# EAGLE design Puzzle Circular LED v0.9b (EAGLE 6.2)
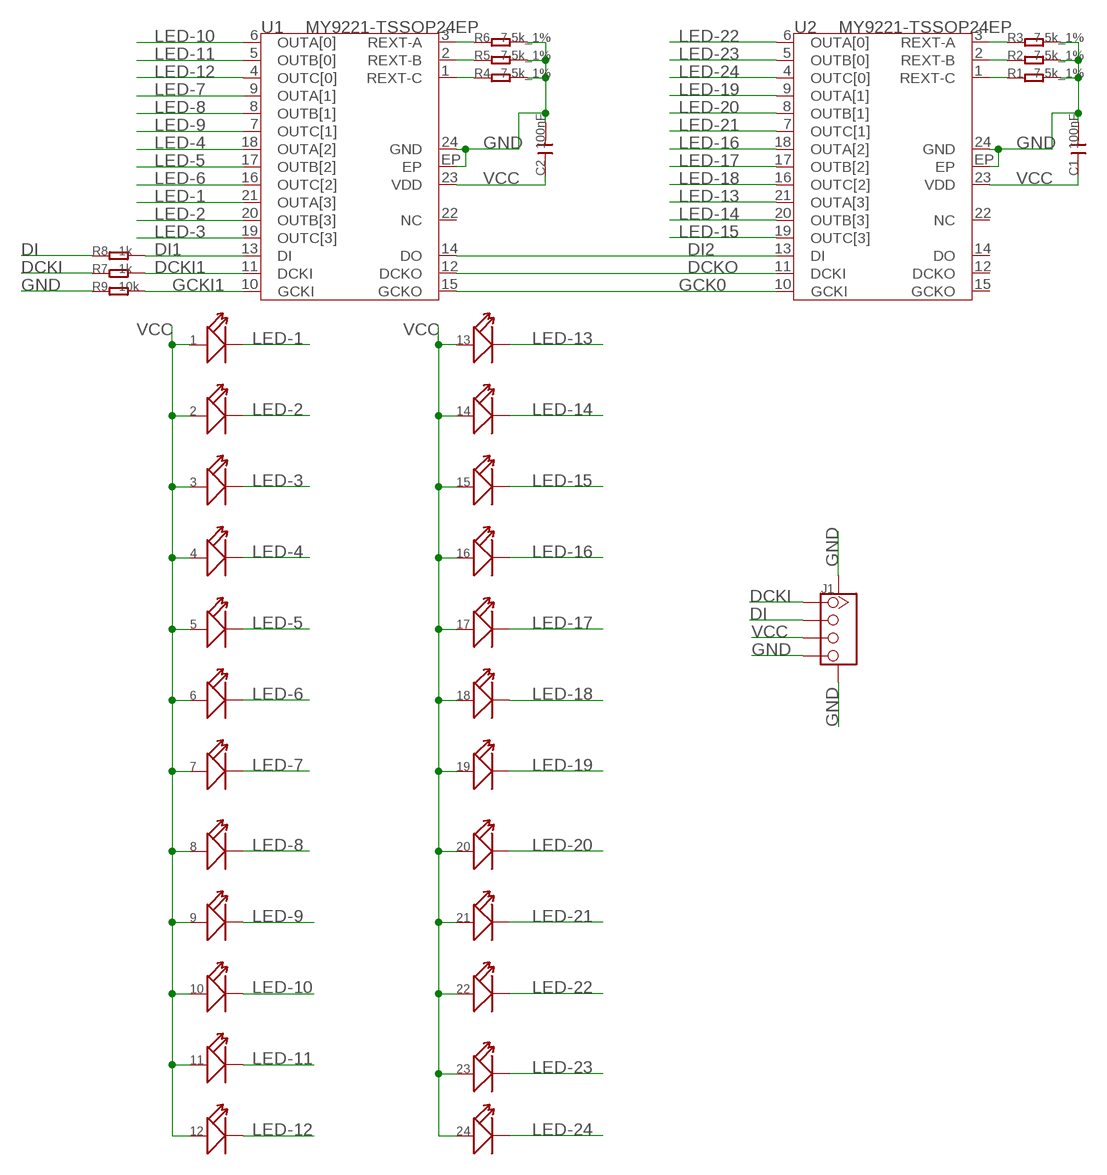
[diagram p0: schematic, sheet 1]

## Parts
1  LED'1206'  [LED-1206]
2  LED'1206'  [LED-1206]
3  LED'1206'  [LED-1206]
4  LED'1206'  [LED-1206]
5  LED'1206'  [LED-1206]
6  LED'1206'  [LED-1206]
7  LED'1206'  [LED-1206]
8  LED'1206'  [LED-1206]
9  LED'1206'  [LED-1206]
10  LED'1206'  [LED-1206]
11  LED'1206'  [LED-1206]
12  LED'1206'  [LED-1206]
13  LED'1206'  [LED-1206]
14  LED'1206'  [LED-1206]
15  LED'1206'  [LED-1206]
16  LED'1206'  [LED-1206]
17  LED'1206'  [LED-1206]
18  LED'1206'  [LED-1206]
19  LED'1206'  [LED-1206]
20  LED'1206'  [LED-1206]
21  LED'1206'  [LED-1206]
22  LED'1206'  [LED-1206]
23  LED'1206'  [LED-1206]
24  LED'1206'  [LED-1206]
C1  100nF  C-0603  [C0603]
C2  100nF  C-0603  [C0603]
J1  TWIG-4P-2.0-SMD-FEMALE-REINFORCE'90D'  [4P-SMD-2.0-90D]
R1  7.5k_1%  R-0603  [R0603]
R2  7.5k_1%  R-0603  [R0603]
R3  7.5k_1%  R-0603  [R0603]
R4  7.5k_1%  R-0603  [R0603]
R5  7.5k_1%  R-0603  [R0603]
R6  7.5k_1%  R-0603  [R0603]
R7  1k  R-0603  [R0603]
R8  1k  R-0603  [R0603]
R9  10k  R-0603  [R0603]
U1  MY9221-TSSOP24EP  [TSSOP24EP]
U2  MY9221-TSSOP24EP  [TSSOP24EP]

## Nets
DCKI: J1.1 R7.1
DCKI1: R7.2 U1.11(DCKI)
DCKO: U1.12(DCKO) U2.11(DCKI)
DI: J1.2 R8.1
DI1: R8.2 U1.13(DI)
DI2: U1.14(DO) U2.13(DI)
GCK0: U1.15(GCKO) U2.10(GCKI)
GCKI1: R9.2 U1.10(GCKI)
GND: C1.2 C2.2 J1.4 J1.SS1 J1.SS2 R1.2 R2.2 R3.2 R4.2 R5.2 R6.2 R9.1 U1.24(GND) U1.EP U2.24(GND) U2.EP
LED-1: 1.- U1.21(OUTA[3])
LED-2: 2.- U1.20(OUTB[3])
LED-3: 3.- U1.19(OUTC[3])
LED-4: 4.- U1.18(OUTA[2])
LED-5: 5.- U1.17(OUTB[2])
LED-6: 6.- U1.16(OUTC[2])
LED-7: 7.- U1.9(OUTA[1])
LED-8: 8.- U1.8(OUTB[1])
LED-9: 9.- U1.7(OUTC[1])
LED-10: 10.- U1.6(OUTA[0])
LED-11: 11.- U1.5(OUTB[0])
LED-12: 12.- U1.4(OUTC[0])
LED-13: 13.- U2.21(OUTA[3])
LED-14: 14.- U2.20(OUTB[3])
LED-15: 15.- U2.19(OUTC[3])
LED-16: 16.- U2.18(OUTA[2])
LED-17: 17.- U2.17(OUTB[2])
LED-18: 18.- U2.16(OUTC[2])
LED-19: 19.- U2.9(OUTA[1])
LED-20: 20.- U2.8(OUTB[1])
LED-21: 21.- U2.7(OUTC[1])
LED-22: 22.- U2.6(OUTA[0])
LED-23: 23.- U2.5(OUTB[0])
LED-24: 24.- U2.4(OUTC[0])
N$5: R1.1 U2.1(REXT-C)
N$6: R2.1 U2.2(REXT-B)
N$7: R4.1 U1.1(REXT-C)
N$8: R5.1 U1.2(REXT-B)
N$9: R6.1 U1.3(REXT-A)
N$10: R3.1 U2.3(REXT-A)
VCC: 1.+ 2.+ 3.+ 4.+ 5.+ 6.+ 7.+ 8.+ 9.+ 10.+ 11.+ 12.+ 13.+ 14.+ 15.+ 16.+ 17.+ 18.+ 19.+ 20.+ 21.+ 22.+ 23.+ 24.+ C1.1 C2.1 J1.3 U1.23(VDD) U2.23(VDD)
Unconnected: U1.22(NC) U2.12(DCKO) U2.14(DO) U2.15(GCKO) U2.22(NC)

## Library data of the parts
1-24 = Discrete:LED*
C1 C2 = Discrete:C*: Ceramic Capacitors
J1 = Connector:TWIG-4P-2.0-SMD-FEMALE-REINFORCE
R1-R9 = Discrete:R*
U1 U2 = For_Test_Albert:MY9221

## Net classes
0 default: width 0.203 mm, drill 0.305 mm, clearance 0.152 mm

## Board
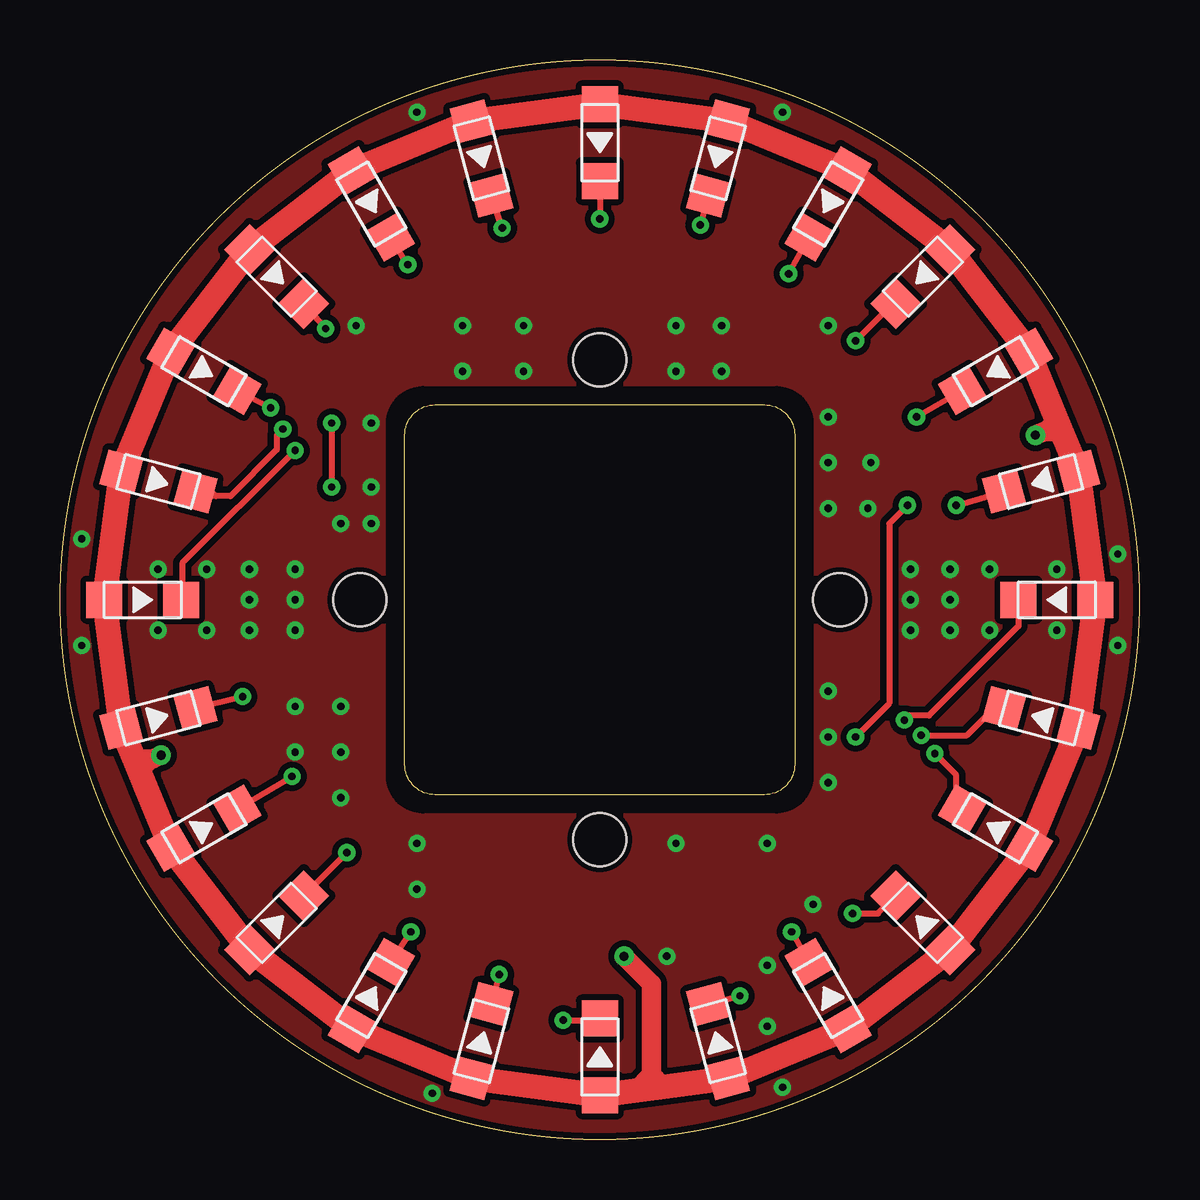
[diagram p1: board, top side]
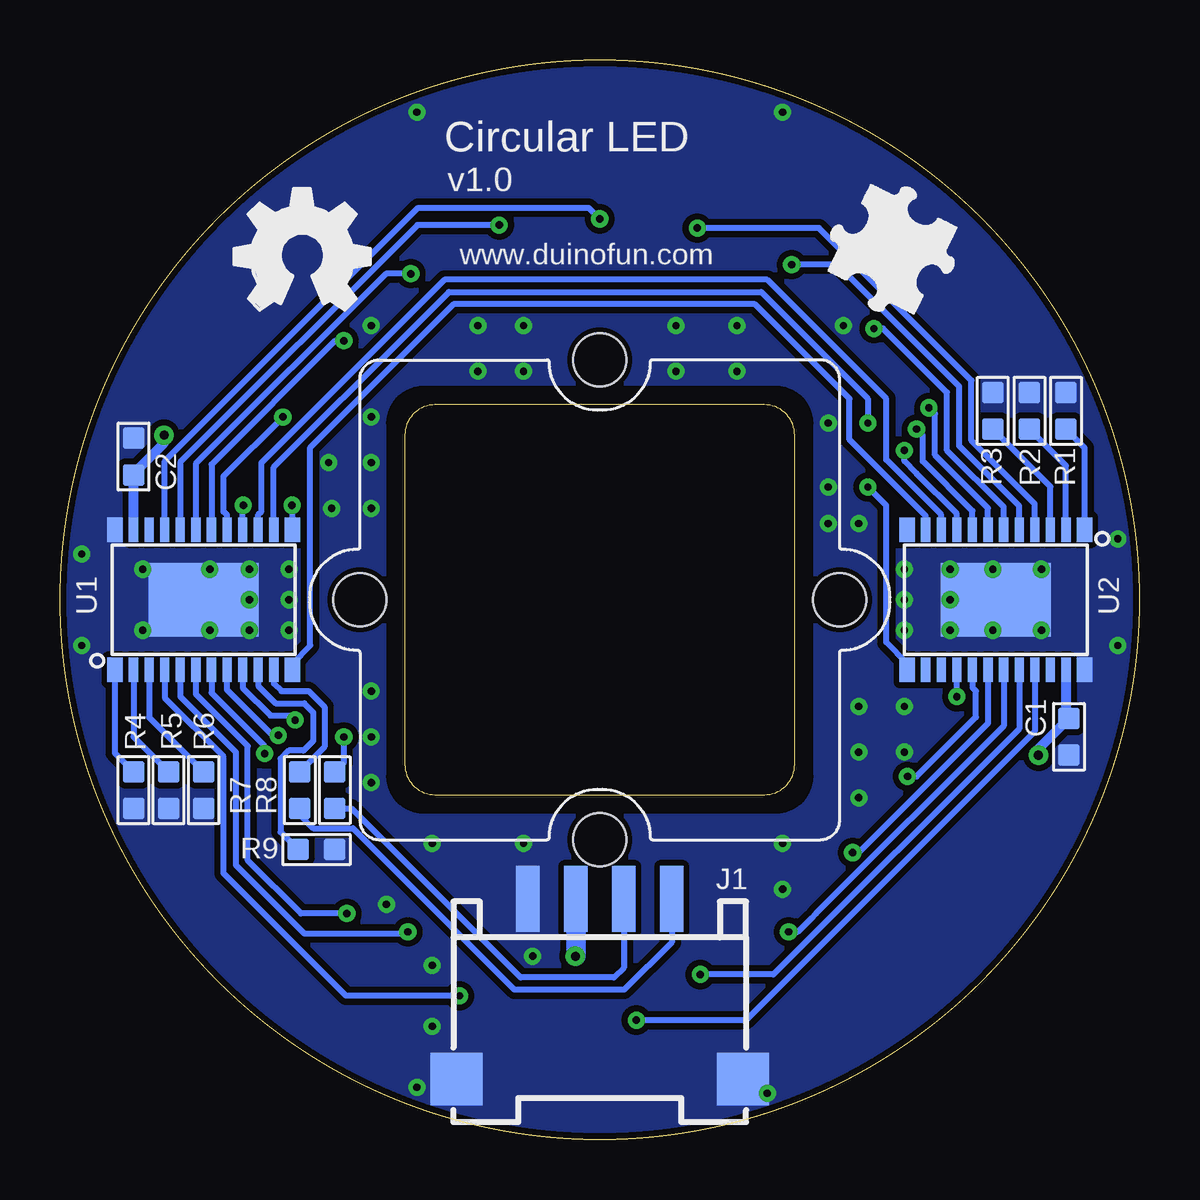
[diagram p2: board, bottom side, seen from below]

Size 45 x 45 mm. Coordinates in mm from the lower left corner, seen from the top.
Outline: 15.64,30.63 29.36,30.63 arc-90 30.63,29.36 30.63,15.64 arc-90 29.36,14.37 15.64,14.37 arc-90 14.37,15.64 14.37,29.36 arc-90 15.64,30.63
Outline: circle at 22.5,22.5 radius 22.5
Copper layers (1*16): Top 0.035mm / dielectric 1.5mm / Bottom 0.035mm
Design rules: minimum track width 8mil, minimum drill 12mil, track to track 8mil, track to pad 8mil, pad to pad 8mil, via to via 8mil, smd to smd 0mil, copper to edge 10mil, drill to drill 8mil, minimum pad ring 10mil, minimum via ring 8mil, stop-mask expansion 4mil, vias tented up to drill 100mil, thermal gap 10mil
Holes 2.2 mm at 22.5,32.5 22.5,12.5
tRestrict: 10 lines
bRestrict: 8 lines

### Footprints (pad centres in the part's own frame; a part is rotated, then mirrored left to right if it is on the bottom)
LED-1206 = smd 1.5 x 1.5: + -1.6,0; - 1.6,0
C0603 = smd 0.889 x 0.889: 1 -0.762,0; 2 0.762,0
4P-SMD-2.0-90D = smd 0.965 x 2.74: 1 -3,-0.1; 2 -1,-0.1; 3 1,-0.1; 4 3,-0.1 | smd 2.159 x 2.184: SS1 -5.974,7.4; SS2 5.974,7.4
R0603 = smd 0.889 x 0.889: 1 -0.762,0; 2 0.762,0
TSSOP24EP = smd 0.635 x 1.016: 1 -3.702,-2.921; 12 3.702,-2.921; 13 3.702,2.921; 24 -3.702,2.921 | smd 0.381 x 1.016: 2 -2.925,-2.921; 3 -2.275,-2.921; 4 -1.625,-2.921; 5 -0.975,-2.921; 6 -0.325,-2.921; 7 0.325,-2.921; 8 0.975,-2.921; 9 1.625,-2.921; 10 2.275,-2.921; 11 2.925,-2.921; 14 2.925,2.921; 15 2.275,2.921; 16 1.625,2.921; 17 0.975,2.921; 18 0.325,2.921; 19 -0.325,2.921; 20 -0.975,2.921; 21 -1.625,2.921; 22 -2.275,2.921; 23 -2.925,2.921 | smd 4.572 x 3.048: EP 0,0
1U-DIM-W/-DRILL-SILK = hole 2.2: 0,-10; 0,10

### Placement (x,y rotation side)
1  22.5,41.55 270 top
2  27.43,40.9 255 top
3  32.02,39 240 top
4  35.97,35.97 225 top
5  39,32.02 210 top
6  40.9,27.43 195 top
7  41.55,22.5 180 top
8  40.9,17.57 165 top
9  39,12.97 150 top
10  35.97,9.03 135 top
11  32.02,6 120 top
12  27.43,4.1 105 top
13  22.5,3.45 90 top
14  17.57,4.1 75 top
15  12.97,6 60 top
16  9.03,9.03 45 top
17  6,12.97 30 top
18  4.1,17.57 15 top
19  3.45,22.5 0 top
20  4.1,27.43 345 top
21  6,32.02 330 top
22  9.03,35.97 315 top
23  12.97,39 300 top
24  17.57,40.9 285 top
C1  2.94,16.79 270 bottom
C2  41.93,28.47 90 bottom
J1  22.5,9.93 180 bottom
R1  3.07,30.37 90 bottom
R2  4.59,30.37 90 bottom
R3  6.12,30.37 90 bottom
R4  41.93,14.56 270 bottom
R5  40.47,14.56 270 bottom
R6  39.01,14.56 270 bottom
R7  35.01,14.56 90 bottom
R8  33.55,14.56 90 bottom
R9  34.31,12.09 180 bottom
U1  39.01,22.5 0 bottom
U2  5.99,22.5 180 bottom
U$1  [BRICK-LOGO-2-B-MIL-0.6]  7.26,34.06 0 top
U$2  [1U-DIM-W/-DRILL-SILK]  22.5,22.5 90 bottom
U$4  [OSHW_FILLX200_NOTEXT]  37.74,34.56 0 bottom

### Tracks (layer width: path | path; a pad name or v marks a point on that pad's centre or on a via)
DCKI
  Bottom 0.254: J1.1 19.5,8.23 21.48,6.24 26.06,6.24 32.79,12.97 34.44,12.97 35.01,13.55 R7.1
DCKI1
  Bottom 0.254: U1.11 36.09,19 35.77,18.69 34.63,18.69 33.97,18.03 33.97,16.37 R7.2
DCKO
  Bottom 0.254: U1.12 35.31,19.85 34.56,20.59 34.56,28.85 28.6,34.82 16.02,34.82 12.09,30.88 12.09,29.17 8.91,26 U2.11
DI
  Bottom 0.254: J1.2 21.5,7.16 21.91,6.75 25.8,6.75 32.85,13.8 R8.1
DI1  (via drill 0.3 pad 0.64)
  Top 0.254: v35.33,26.44 34.56,25.68 34.56,18.18 v33.17,16.79
  Bottom 0.254: 35.33,25.44 U1.13 35.31,26.42 v35.33,26.44 | v33.17,16.79 33.17,15.71 R8.2
DI2  (via drill 0.3 pad 0.64)
  Top 0.254: v11.32,29.87 v11.32,27.2
  Bottom 0.254: U1.14 36.09,28.03 30.37,33.74 28.79,35.33 15.77,35.33 11.32,30.88 v11.32,29.87 | U2.13 9.69,19.85 10.56,20.72 10.56,26.44 v11.32,27.2
GCK0
  Bottom 0.254: U1.15 36.73,26.05 36.6,26.18 36.6,28.21 28.98,35.84 15.52,35.84 10.56,30.88 10.56,28.34 8.27,26.05 U2.10
GCKI1
  Bottom 0.254: U1.10 36.73,18.91 36.01,18.18 34.82,18.18 34.44,17.8 34.44,16.62 34.84,16.21 35.46,16.21 35.8,15.87 35.8,12.82 R9.2
GND  (via drill 0.3 pad 0.64)
  other vias: 7.89,21.23 6.12,21.23 7.89,22.5 6.12,23.77 35.45,23.77 35.45,21.23 35.45,22.5 4.09,23.77 4.09,21.23 41.55,21.23 41.55,23.77 7.89,23.77 9.8,23.77 9.8,22.5 9.8,21.23 9.8,18.05 11.71,18.05 11.71,16.15 11.71,14.24 9.8,16.15 25.68,12.34 25.29,7.64 29.48,4.72 29.48,7.26 31.39,9.8 29.48,12.34 32.02,14.88 32.02,16.79 32.02,18.69 32.02,26.31 32.02,28.21 32.02,30.12 37.11,22.5 37.11,21.23 37.11,23.77 38.76,23.77 38.76,21.23 33.68,26.31 33.8,28.21 11.71,25.68 12.97,25.68 12.97,27.2 12.97,29.87 14.88,12.34 14.88,10.44 16.79,33.93 16.79,32.02 19.32,32.02 19.32,33.93 25.68,32.02 25.68,33.93 27.58,33.93 27.58,32.02 32.02,33.93 12.34,33.93 30.12,2.18 15.52,1.93 30.12,42.82 14.88,42.82 0.91,25.04 0.91,20.59 44.09,24.41 44.09,20.59
  pour Bottom (isolate 0.254, no thermals): -0.36,46 46,46 46,-1 -0.36,-1
  pour Top (isolate 0.254, no thermals): -0.36,46 46,46 46,-1 -0.36,-1
LED-1  (via drill 0.3 pad 0.64)
  Top 0.254: 1.- v22.5,38.38
  Bottom 0.254: U1.21 40.64,28.27 30.07,38.84 22.96,38.84 v22.5,38.38
LED-2  (via drill 0.3 pad 0.64)
  Top 0.254: 2.- v26.69,38.12
  Bottom 0.254: v26.69,38.12 30.1,38.12 39.98,28.24 U1.20
LED-3  (via drill 0.3 pad 0.64)
  Top 0.254: 3.- v30.37,36.09
  Bottom 0.254: v30.37,36.09 31.42,36.09 39.34,28.17 U1.19
LED-4  (via drill 0.3 pad 0.64)
  Top 0.254: 4.- 34.71,34.84 v33.17,33.3
  Bottom 0.254: v33.17,33.3 33.53,33.3 38.69,28.14 U1.18
LED-5  (via drill 0.3 pad 0.64)
  Top 0.254: 5.- v35.71,30.12
  Bottom 0.254: v35.71,30.12 38.18,27.65 38.18,26.18 38.03,26.03 U1.17
LED-6  (via drill 0.3 pad 0.64)
  Top 0.254: v37.36,26.44 6.-
  Bottom 0.254: U1.16 37.38,26.41 v37.36,26.44
LED-7  (via drill 0.3 pad 0.64)
  Top 0.254: 7.- 39.95,21.4 36.23,17.67 35.39,17.67 v35.2,17.48
  Bottom 0.254: U1.9 37.38,18.83 36.23,17.67 35.39,17.67 v35.2,17.48
LED-8  (via drill 0.3 pad 0.64)
  Top 0.254: v35.9,16.85 37.8,16.85 38.94,17.98 8.-
  Bottom 0.254: v35.9,16.85 36.13,16.85 38.03,18.75 U1.8
LED-9  (via drill 0.3 pad 0.64)
  Top 0.254: 9.- 37.58,13.78 37.36,13.99 37.36,15.2 v36.47,16.09
  Bottom 0.254: U1.7 38.69,18.62 36.47,16.4 v36.47,16.09
LED-10  (via drill 0.3 pad 0.64)
  Top 0.254: v33.04,9.42 34.1,9.42 10.-
  Bottom 0.254: U1.6 39.34,18.57 37.17,16.4 37.17,11.63 34.96,9.42 v33.04,9.42
LED-11  (via drill 0.3 pad 0.64)
  Top 0.254: v30.5,8.66 11.-
  Bottom 0.254: U1.5 39.98,18.46 37.68,16.15 37.68,11.44 34.82,8.58 30.57,8.58 v30.5,8.66
LED-12  (via drill 0.3 pad 0.64)
  Top 0.254: 12.- v28.34,5.99
  Bottom 0.254: v28.34,5.99 33.08,5.99 38.18,11.1 38.18,15.96 40.64,18.41 U1.4
LED-13  (via drill 0.3 pad 0.64)
  Top 0.254: v20.98,4.97 22.42,4.97 13.-
  Bottom 0.254: U2.21 4.36,17.01 16.4,4.97 v20.98,4.97
LED-14  (via drill 0.3 pad 0.64)
  Top 0.254: v18.31,6.88 14.-
  Bottom 0.254: U2.20 5.02,17.12 15.26,6.88 v18.31,6.88
LED-15  (via drill 0.3 pad 0.64)
  Top 0.254: 15.- v14.63,8.66
  Bottom 0.254: U2.19 5.66,17.24 13.48,9.42 13.67,9.23 14.24,8.66 v14.63,8.66
LED-16  (via drill 0.3 pad 0.64)
  Top 0.254: 16.- v11.96,11.96
  Bottom 0.254: U2.18 6.32,17.35 11.71,11.96 v11.96,11.96
LED-17  (via drill 0.3 pad 0.64)
  Top 0.254: 17.- v9.67,15.13
  Bottom 0.254: v9.67,15.13 9.29,15.13 6.82,17.61 6.82,18.69 6.96,18.84 U2.17
LED-18  (via drill 0.3 pad 0.64)
  Top 0.254: 18.- v7.62,18.46
  Bottom 0.254: v7.62,18.46 U2.16
LED-19  (via drill 0.3 pad 0.64)
  Top 0.254: v9.8,28.72 5.1,24.02 5.1,22.55 19.-
  Bottom 0.254: U2.9 7.62,26.09 9.29,27.77 9.8,28.28 v9.8,28.72
LED-20  (via drill 0.3 pad 0.64)
  Top 0.254: v9.29,29.61 9.04,29.36 9.04,28.75 7.11,26.82 6.5,26.82 | 6.5,26.82 5.84,26.82 20.- | 6.5,26.82 6.12,27.2
  Bottom 0.254: U2.8 6.96,26.2 9.04,28.28 9.04,29.36 v9.29,29.61
LED-21  (via drill 0.3 pad 0.64)
  Top 0.254: 21.- v8.78,30.5
  Bottom 0.254: U2.7 6.32,26.32 8.53,28.53 8.53,30.25 v8.78,30.5
LED-22  (via drill 0.3 pad 0.64)
  Top 0.254: 22.- v11.07,33.8
  Bottom 0.254: U2.6 5.66,26.37 8.02,28.72 8.02,31.14 10.69,33.8 v11.07,33.8
LED-23  (via drill 0.3 pad 0.64)
  Top 0.254: v14.5,36.47 23.-
  Bottom 0.254: U2.5 5.02,26.41 7.51,28.91 7.51,31.39 12.59,36.47 v14.5,36.47
LED-24  (via drill 0.3 pad 0.64)
  Top 0.254: v18.44,37.99 24.-
  Bottom 0.254: U2.4 4.36,26.49 7.01,29.13 7.01,31.64 13.36,37.99 v18.44,37.99
N$5
  Bottom 0.254: U2.1 2.29,28.83 R1.1
N$6
  Bottom 0.254: U2.2 3.07,28.08 R2.1
N$7
  Bottom 0.254: U1.1 42.71,16.11 R4.1
N$8
  Bottom 0.254: U1.2 41.94,16.79 R5.1
N$9
  Bottom 0.254: U1.3 41.28,17.6 R6.1
N$10
  Bottom 0.254: U2.3 3.71,27.21 R3.1
VCC  (via drill 0.38 pad 0.81)
  Top 0.813: v40.66,29.36 41.03,29.52 | 41.03,29.52 41.64,29.78 | v23.52,7.64 24.66,6.5 24.66,2.69 | 24.66,2.69 24.66,2.36 24.86,2.16 | v4.21,16.02 3.86,15.86 | 3.86,15.86 3.21,15.57 | 24.66,2.69 24.02,2.05 | 24.66,2.69 25.04,2.31 | 3.8,15.86 3.23,15.86 3.2,15.9 | 3.86,15.86 3.8,15.86 | 3.8,15.86 3.32,15.39 | 41.03,29.52 41.07,29.52 | 41.07,29.52 41.55,29.99 | 41.07,29.52 41.64,29.52 41.93,29.23
  Top 1.016: 24.+ 1.+ 2.+ 3.+ 4.+ 5.+ 41.64,29.78 6.+ 7.+ 8.+ 9.+ 10.+ 11.+ 12.+ 24.86,2.16 13.+ 14.+ 15.+ 16.+ 17.+ 3.57,14.7 3.21,15.57 18.+ 19.+ 20.+ 21.+ 22.+ 23.+ 24.+
  Bottom 0.406: v40.66,29.36 40.66,29.04 41.94,27.77 41.93,27.76 C2.1 U1.23 | U2.23 3.07,17.67 C1.1 2.95,17.55 4.21,16.29 v4.21,16.02
  Bottom 0.813: J1.3 23.5,7.66 v23.52,7.64

### Text on the board
bPlace: Circular LED | v1.0 | www.duinofun.com